# Altium schematic sheet R1.SchDoc: R1 Interface+Power
size A3; Author: Mohammed; CompanyName: SRM Team Robocon; DrawnBy: Mohammed; SheetNumber: 1; SheetTotal: 1
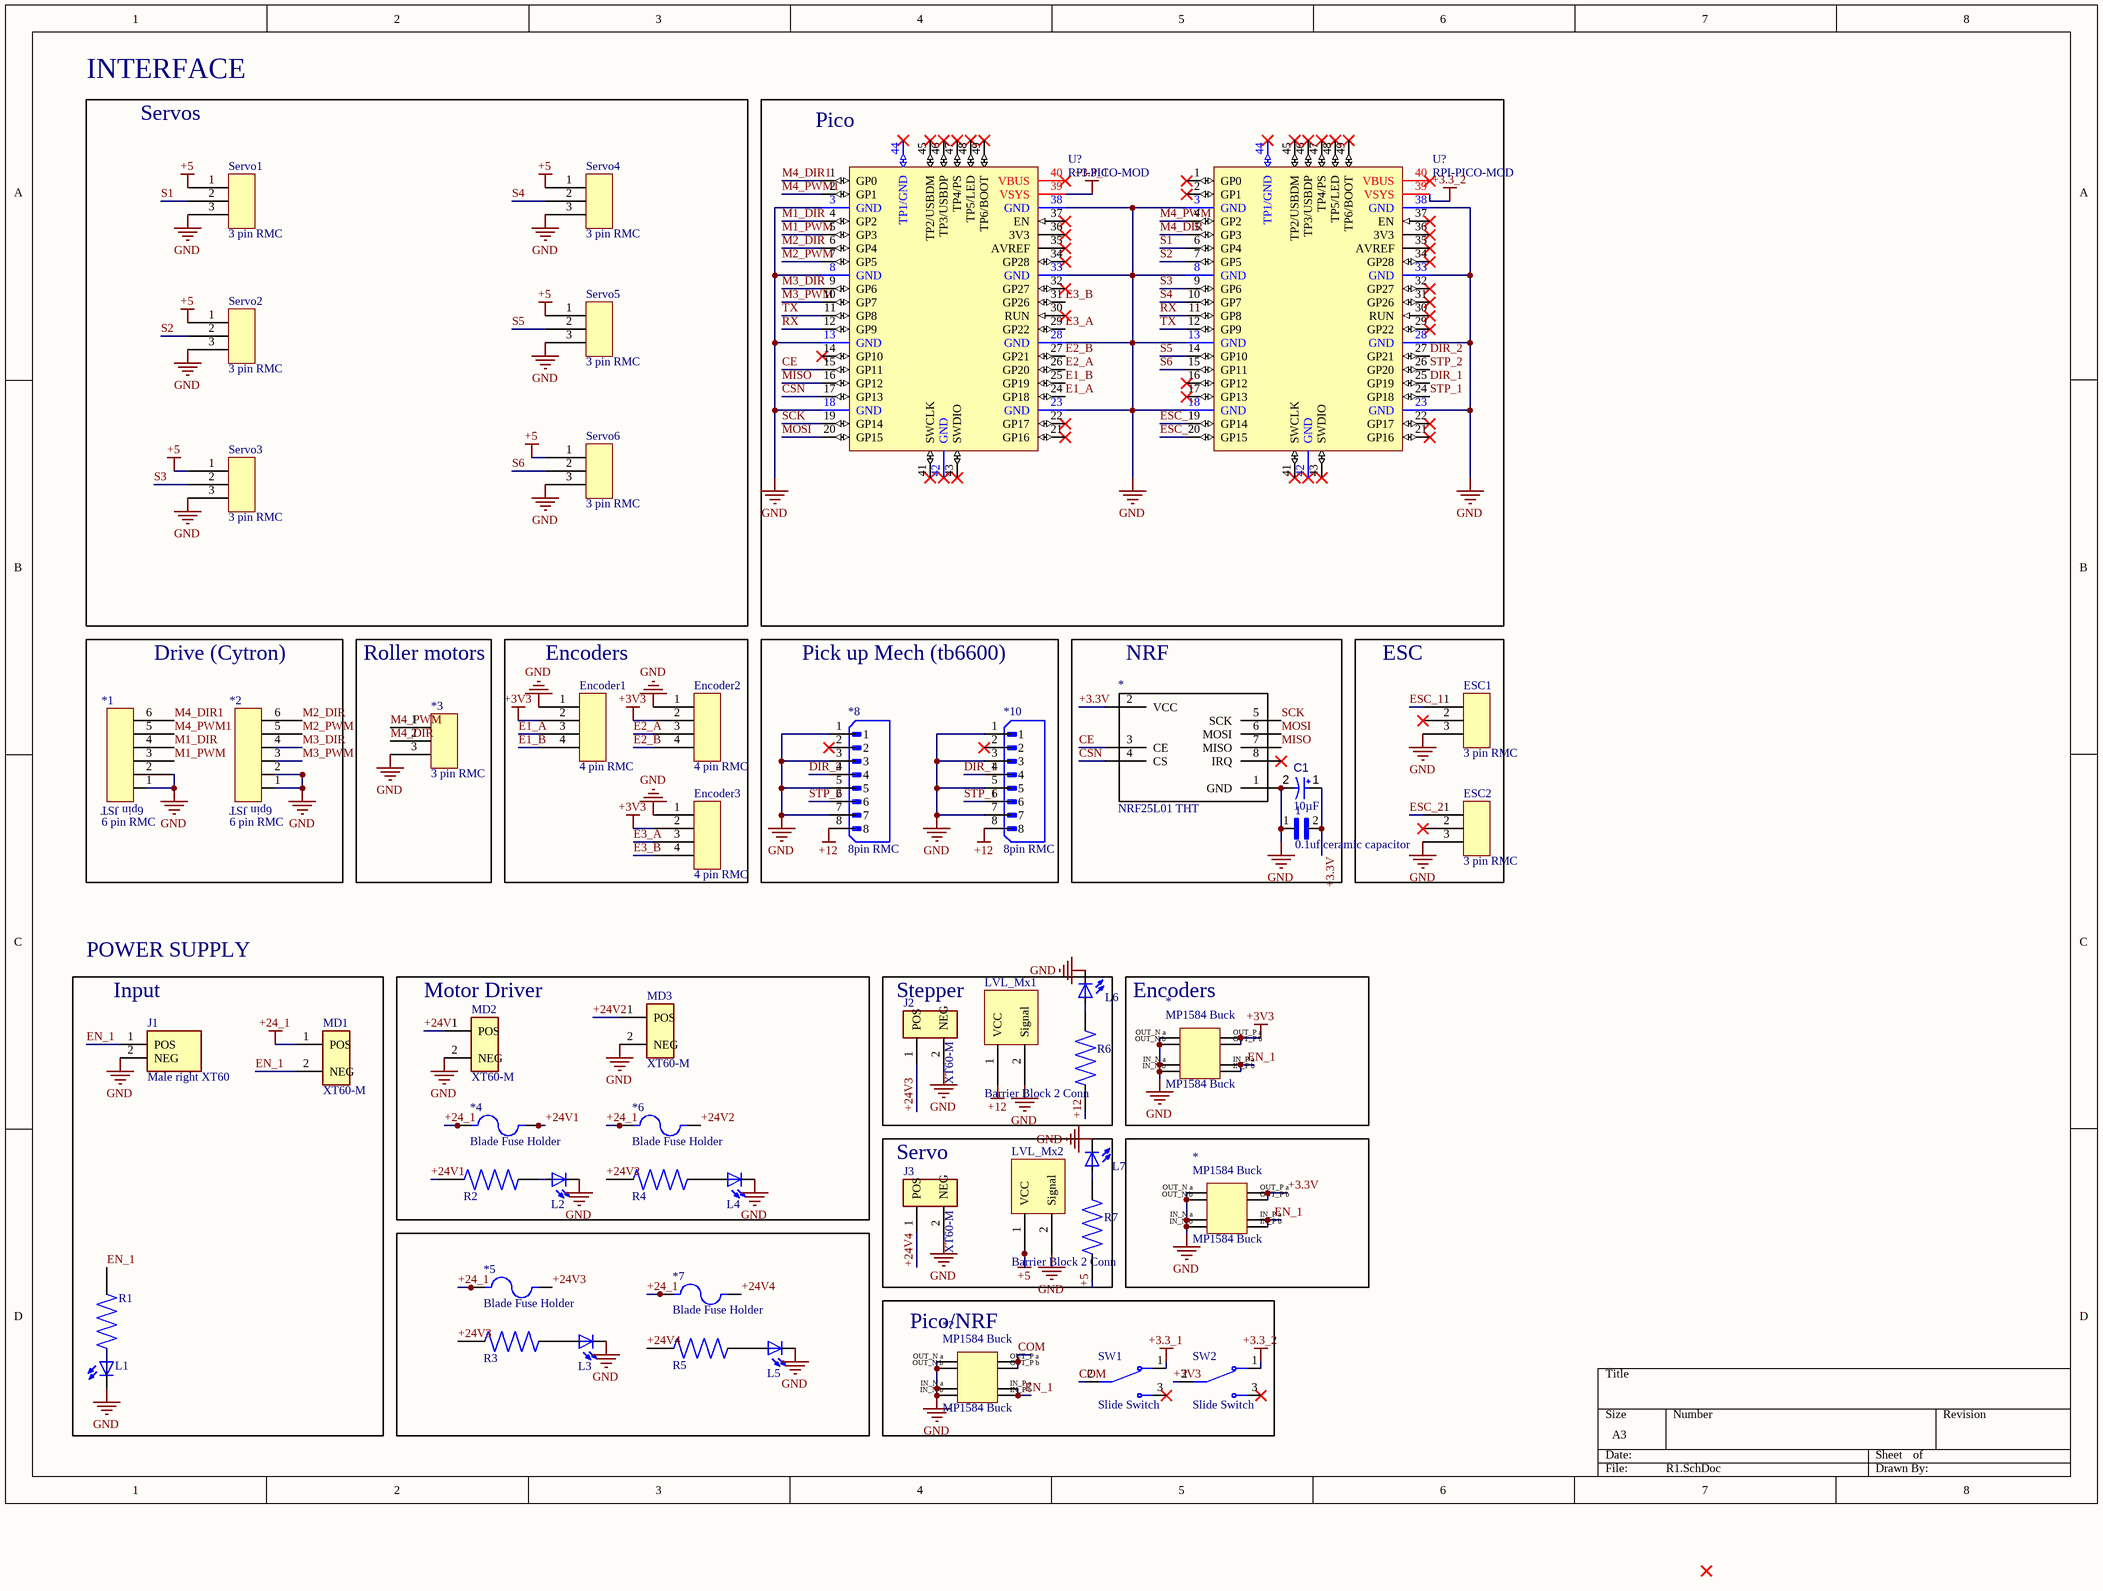
[diagram p0: R1.SchDoc]

## Parts
(Parts that share a designator on the sheet are numbered #1, #2 ... from top to bottom, then left to right.)
1  0.1uf ceramic capacitor  [0.1uf ceramic capacitor]
*1  6 pin RMC  [6 pin RMC]
*2  6 pin RMC  [6 pin RMC]
*3  3 pin RMC  [Header JST 1X03]
*4  Blade Fuse Holder  [Blade fuse holder]
*5  Blade Fuse Holder  [Blade fuse holder]
*6  Blade Fuse Holder  [Blade fuse holder]
*7  Blade Fuse Holder  [Blade fuse holder]
*8  8pin RMC  [8pin RMC]
*10  8pin RMC  [8pin RMC]
*#1  NRF25L01 THT  [NRF25L01 THT]
*#2  MP1584 Buck  [MP1584 Buck]
*#3  MP1584 Buck  [MP1584 Buck]
*?  MP1584 Buck  [MP1584 Buck]
C1  value 10µF  [CAPPR55-200-1100X500X1200]  (hidden comment: ECA1HM100)
Encoder1  4 pin RMC  [Header JST 1X04]
Encoder2  4 pin RMC  [Header JST 1X04]
Encoder3  4 pin RMC  [Header JST 1X04]
ESC1  3 pin RMC  [Header JST 1X03]
ESC2  3 pin RMC  [Header JST 1X03]
J1  Male right XT60  [XT60M Right]
J2  XT60-M  [XT-60M]
J3  XT60-M  [XT-60M]
L1  LED 3mm  [LED 3mm]  (value not drawn)
L2  LED 3mm  [LED 3mm]  (value not drawn)
L3  LED 3mm  [LED 3mm]  (value not drawn)
L4  LED 3mm  [LED 3mm]  (value not drawn)
L5  LED 3mm  [LED 3mm]  (value not drawn)
L6  LED 3mm  [LED 3mm]  (value not drawn)
L7  LED 3mm  [LED 3mm]  (value not drawn)
LVL_Mx1  Barrier Block 2 Conn  [2 Barrier Block 5mm]
LVL_Mx2  Barrier Block 2 Conn  [2 Barrier Block 5mm]
MD1  XT60-M  [XT-60M]
MD2  XT60-M  [XT-60M]
MD3  XT60-M  [XT-60M]
R1  1kOhm resistor  [1kOhm Resistor]  (value not drawn)
R2  1kOhm resistor  [1kOhm Resistor]  (value not drawn)
R3  1kOhm resistor  [1kOhm Resistor]  (value not drawn)
R4  1kOhm resistor  [1kOhm Resistor]  (value not drawn)
R5  1kOhm resistor  [1kOhm Resistor]  (value not drawn)
R6  1kOhm resistor  [1kOhm Resistor]  (value not drawn)
R7  1kOhm resistor  [1kOhm Resistor]  (value not drawn)
Servo1  3 pin RMC  [Header JST 1X03]
Servo2  3 pin RMC  [Header JST 1X03]
Servo3  3 pin RMC  [Header JST 1X03]
Servo4  3 pin RMC  [Header JST 1X03]
Servo5  3 pin RMC  [Header JST 1X03]
Servo6  3 pin RMC  [Header JST 1X03]
SW1  Slide Switch  [Slide Switch]
SW2  Slide Switch  [Slide Switch]
U?#1  RPI-PICO-MOD  [RPI-PICO-MOD]
U?#2  RPI-PICO-MOD  [RPI-PICO-MOD]

## Blocks framed on the sheet
INTERFACE: Servo1-Servo6
Pico: U?#1 U?#2
Drive (Cytron): *1 *2
Roller motors: *3
Encoders: Encoder1-Encoder3
Pick up Mech (tb6600): *8 *10
NRF: 1 *#1 C1
ESC: ESC1 ESC2
Motor Driver: *4 *6 L2 L4 MD2 MD3 R2 R4
Stepper: J2 L6 LVL_Mx1 R6
Encoders: *#2
Servo: J3 L7 LVL_Mx2 R7

## Nets
+3.3_1: SW1.1(NC) U?#1.39(VSYS)
+3.3_2: SW2.1(NC) U?#2.39(VSYS)
+3V3: *#2.OUT_P_a(OUT_P_b) *#2.OUT_P_b Encoder1.2 Encoder2.2 Encoder3.2 SW2.2(COM)
+5: LVL_Mx2.1(VCC) R7.1 Servo1.1 Servo2.1 Servo3.1 Servo4.1 Servo5.1 Servo6.1
+12: *8.8 *10.8 LVL_Mx1.1(VCC) R6.1
+24_1: *4.1_1 *4.1_2 *5.1_1 *5.1_2 *6.1_1 *6.1_2 *7.1_1 *7.1_2 MD1.1(POS)
GND: 1.1 *1.1 *1.2 *2.1 *2.2 *3.3 *8.1 *8.3 *8.5 *8.7 *10.1 *10.3 *10.5 *10.7 *#1.1(GND) *#2.IN_N_a *#2.IN_N_b *#2.OUT_N_a *#2.OUT_N_b *#3.IN_N_a *#3.IN_N_b *#3.OUT_N_a *#3.OUT_N_b *?.IN_N_a *?.IN_N_b *?.OUT_N_a *?.OUT_N_b C1.2 Encoder1.1 Encoder2.1 Encoder3.1 ESC1.3 ESC2.3 J1.2(NEG) J2.2(NEG) J3.2(NEG) L1.K(C) L2.K(C) L3.K(C) L4.K(C) L5.K(C) L6.K(C) L7.K(C) LVL_Mx1.2(Signal) LVL_Mx2.2(Signal) MD2.2(NEG) MD3.2(NEG) Servo1.3 Servo2.3 Servo3.3 Servo4.3 Servo5.3 Servo6.3 U?#1.3(GND) U?#1.8(GND) U?#1.13(GND) U?#1.18(GND) U?#1.23(GND) U?#1.28(GND) U?#1.33(GND) U?#1.38(GND) U?#2.3(GND) U?#2.8(GND) U?#2.13(GND) U?#2.18(GND) U?#2.23(GND) U?#2.28(GND) U?#2.33(GND) U?#2.38(GND)
+3.3V: 1.2 *#1.2(VCC) *#3.OUT_P_a(OUT_P_b) *#3.OUT_P_b C1.1
+24V1: *4.2_1 *4.2_2 MD2.1(POS) R2.1
+24V2: *6.2_1 *6.2_2 MD3.1(POS) R4.1
+24V3: *5.2_1 *5.2_2 J2.1(POS) R3.1
+24V4: *7.2_1 *7.2_2 J3.1(POS) R5.1
CE: *#1.3(CE) U?#1.15(GP11)
COM: *?.OUT_P_a(OUT_P_b) *?.OUT_P_b SW1.2(COM)
CSN: *#1.4(CS) U?#1.17(GP13)
DIR_1: *10.4 U?#2.25(GP19)
DIR_2: *8.4 U?#2.27(GP21)
E1_A: Encoder1.3 U?#1.24(GP18)
E1_B: Encoder1.4 U?#1.25(GP19)
E2_A: Encoder2.3 U?#1.26(GP20)
E2_B: Encoder2.4 U?#1.27(GP21)
E3_A: Encoder3.3 U?#1.29(GP22)
E3_B: Encoder3.4 U?#1.31(GP26)
EN_1: *#2.IN_P_a *#2.IN_P_b *#3.IN_P_a *#3.IN_P_b *?.IN_P_a *?.IN_P_b J1.1(POS) MD1.2(NEG) R1.1
ESC_1: ESC1.1 U?#2.19(GP14)
ESC_2: ESC2.1 U?#2.20(GP15)
M1_DIR: *1.4 U?#1.4(GP2)
M1_PWM: *1.3 U?#1.5(GP3)
M2_DIR: *2.6 U?#1.6(GP4)
M2_PWM: *2.5 U?#1.7(GP5)
M3_DIR: *2.4 U?#1.9(GP6)
M3_PWM: *2.3 U?#1.10(GP7)
M4_DIR: *3.2 U?#2.5(GP3)
M4_DIR1: *1.6 U?#1.1(GP0)
M4_PWM: *3.1 U?#2.4(GP2)
M4_PWM1: *1.5 U?#1.2(GP1)
MISO: *#1.7(MISO) U?#1.16(GP12)
MOSI: *#1.6(MOSI) U?#1.20(GP15)
RX: U?#1.12(GP9) U?#2.11(GP8)
S1: Servo1.2 U?#2.6(GP4)
S2: Servo2.2 U?#2.7(GP5)
S3: Servo3.2 U?#2.9(GP6)
S4: Servo4.2 U?#2.10(GP7)
S5: Servo5.2 U?#2.14(GP10)
S6: Servo6.2 U?#2.15(GP11)
SCK: *#1.5(SCK) U?#1.19(GP14)
STP_1: *10.6 U?#2.24(GP18)
STP_2: *8.6 U?#2.26(GP20)
TX: U?#1.11(GP8) U?#2.12(GP9)
NetL1_A: L1.A R1.2
NetL2_A: L2.A R2.2
NetL3_A: L3.A R3.2
NetL4_A: L4.A R4.2
NetL5_A: L5.A R5.2
NetL6_A: L6.A R6.2
NetL7_A: L7.A R7.2

Not connected (* = marked no-connect by the designer): *8 2*; *10 2*; *#1 8(IRQ)*; ESC1 2*; ESC2 2*; SW1 3(NO)*; SW2 3(NO)*; U?#1 14(GP10)* 21(GP16)* 22(GP17)* 30(RUN)* 32(GP27)* 34(GP28)* 35(AVREF)* 36(3V3)* 37(EN)* 40(VBUS)* 41(SWCLK)* 42(GND)* 43(SWDIO)* 44(TP1/GND)* 45(TP2/USBDM)* 46(TP3/USBDP)* 47(TP4/PS)* 48(TP5/LED)* 49(TP6/BOOT)*; U?#2 1(GP0)* 2(GP1)* 16(GP12)* 17(GP13)* 21(GP16)* 22(GP17)* 29(GP22)* 30(RUN)* 31(GP26)* 32(GP27)* 34(GP28)* 35(AVREF)* 36(3V3)* 37(EN)* 40(VBUS)* 41(SWCLK)* 42(GND)* 43(SWDIO)* 44(TP1/GND)* 45(TP2/USBDM)* 46(TP3/USBDP)* 47(TP4/PS)* 48(TP5/LED)* 49(TP6/BOOT)*

## Notes on the sheet
- Servos
- POWER SUPPLY
- (near J1) Input
- (near *?) Pico/NRF
- (in symbol 6 pin RMC) 6pin JST

## Library data of the parts
C1 = CMP-001-00025-6: Aluminum Electrolytic Capacitor, 10 uF, +/- 20%, 50 V, -40 to 85 degC, 2-Pin THD, RoHS, Bulk; Manufacturer: Panasonic; Manufacturer Part Number: ECA-1HM100; Voltage Rating: 50V; Ripple Current (AC): 65mA; Capacitor Type: Electrolytic; Case/Package: Radial; Datasheet URL: https://industrial.panasonic.com/cdbs/www-data/pdf/RDF0000/ABA0000C1218.pdf; Package Description: 2-Pin Radial Lead, Dia 5 mm, Height 12 mm; Mounting Technology: TH; Tolerance: 20%; Packaging: Bulk; Datasheet Version: Rev. 05, 10/2016; Min Operating Temperature: -40°C; Lead Pitch: 2mm; Pins: 2; Diameter: 5mm; Ripple Current: 65mA; Package Reference: CAPPR55-200-1100X500X1200; Manufacturer URL: http://www.panasonic.com/; RoHS Compliant: True; Package Quantity: 200; Max Operating Temperature: 85°C; Component Type: Capacitors
J1 = XT60M Right
J2 J3 MD1-MD3 = XT60-M: Plug; DC supply; XT60; male; PIN: 2; for cable; soldered; 30A; 500V; MF: AMASS; MP: XT60-M; Price: None; Package: Package Analog Devices; Value: *; Availability: Unavailable; SnapEDA_Link: https://www.snapeda.com/parts/XT60-M/AMASS/view-part/2883912/?ref=snap
LVL_Mx1 LVL_Mx2 = Barrier Block 2 Conn_1
U?#1 U?#2 = RPI-PICO-MOD: RASPBERRY PI PICO RP2040 BOARD; Manufacturer: Raspberry Pi Foundation; Manufacturer Part No: SC0915; Mounting Technology: SMT; Supplier: DigiKey; Supplier Part No: 2648-SC0915CT-ND; Supplier Link: https://www.digikey.com/en/products/detail/raspberry-pi/SC0915/13684020